# EAGLE design Sonde (EAGLE 8.0.2)
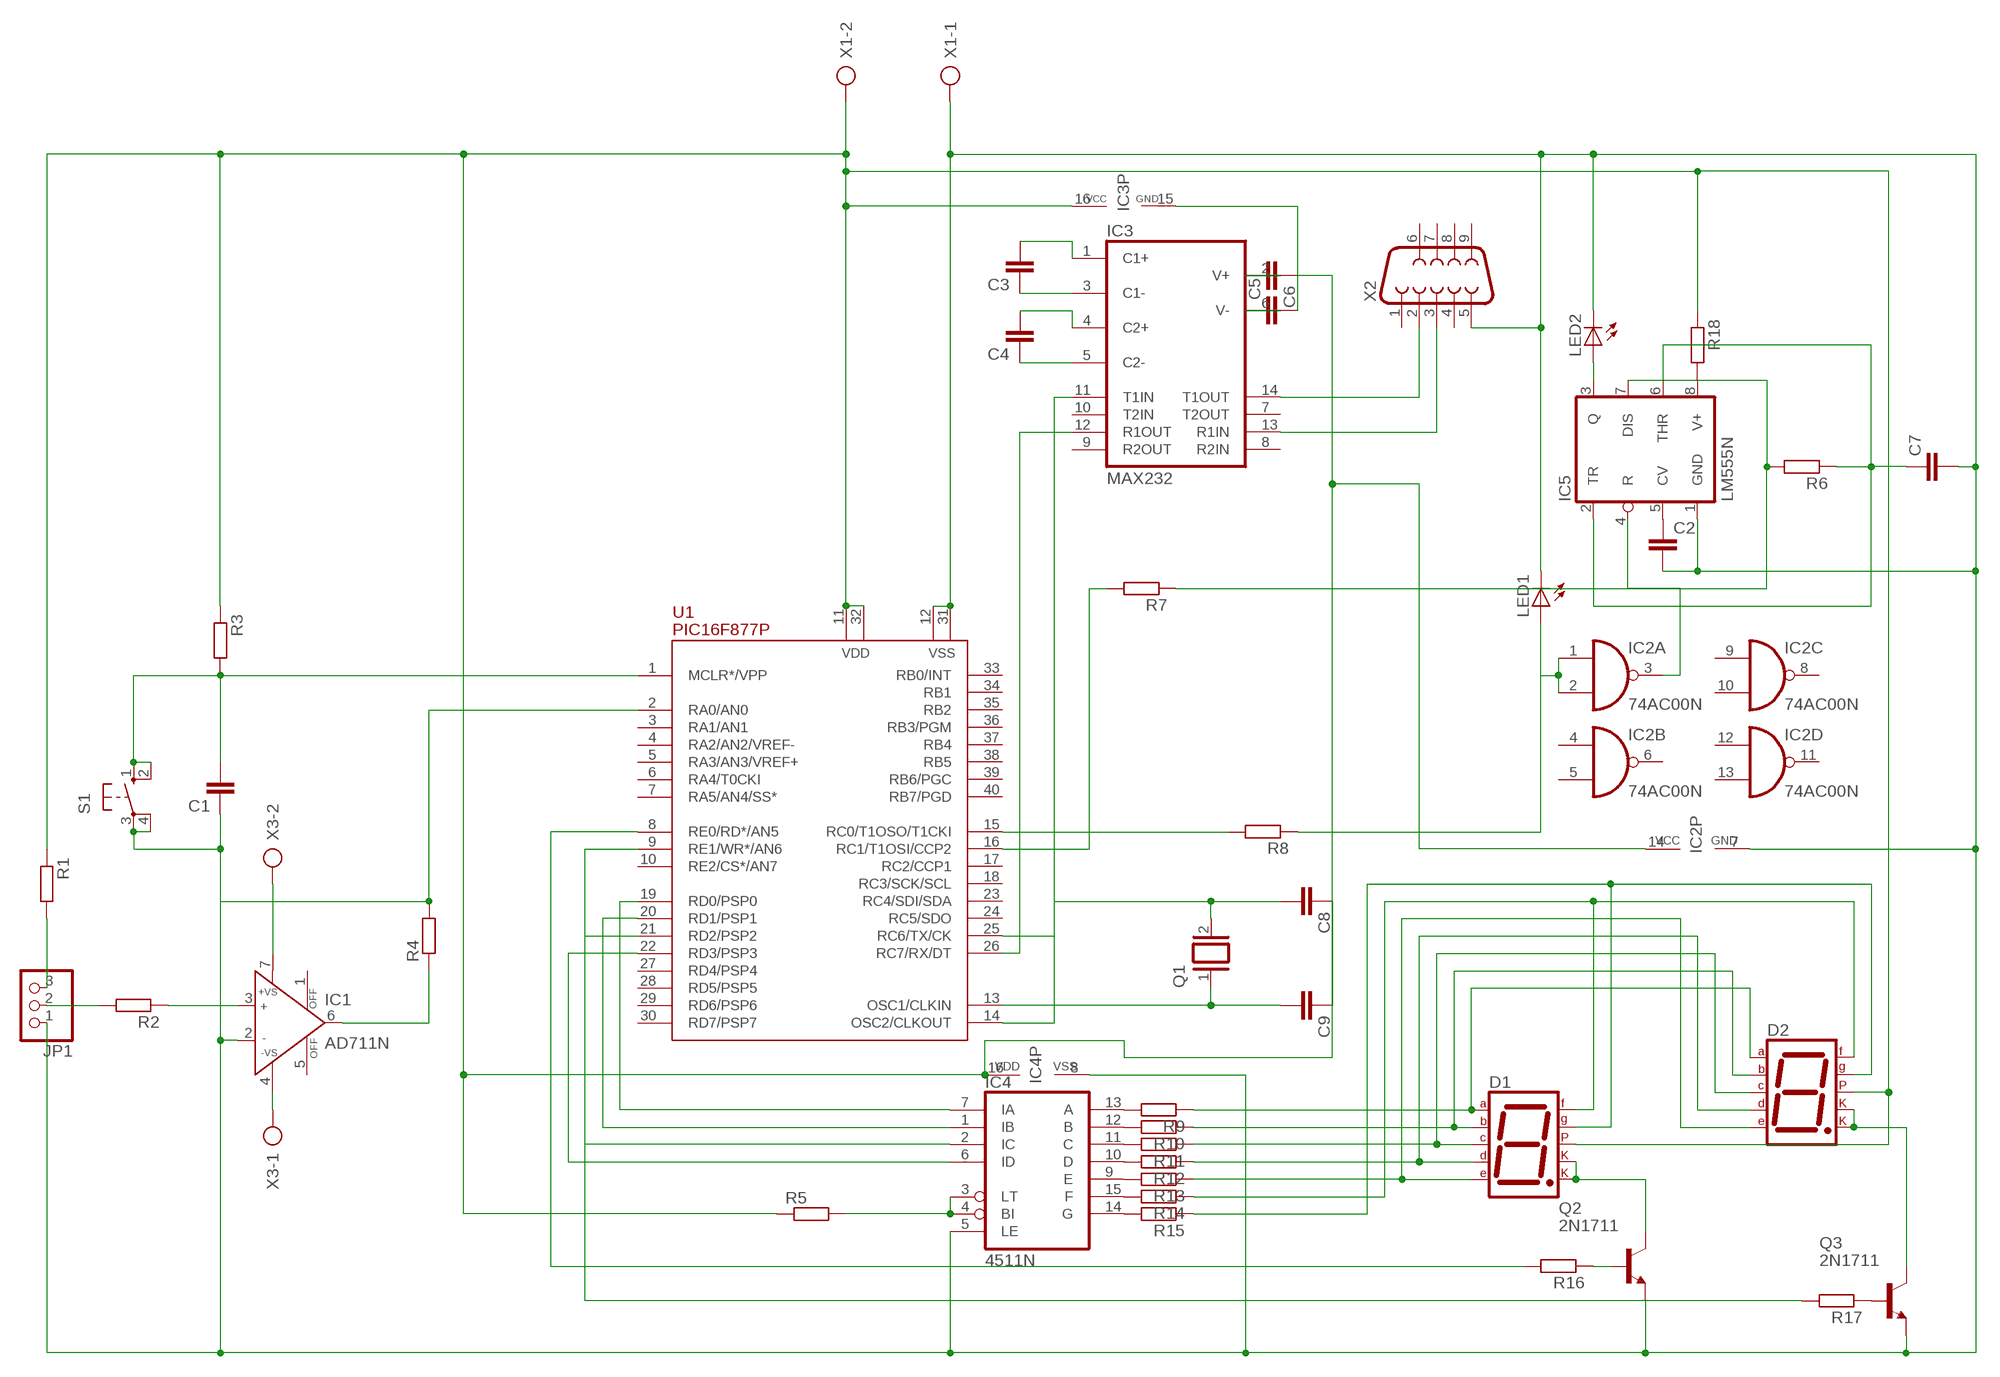
[diagram p0: schematic, sheet 1]

## Parts
C1  C-EU025-024X044  [C025-024X044]
C2  C-EU025-024X044  [C025-024X044]
C3  C-EU025-024X044  [C025-024X044]
C4  C-EU025-024X044  [C025-024X044]
C5  C-EU025-024X044  [C025-024X044]
C6  C-EU025-024X044  [C025-024X044]
C7  C-EU025-024X044  [C025-024X044]
C8  C-EU025-024X044  [C025-024X044]
C9  C-EU025-024X044  [C025-024X044]
D1  7SEG-CK  [7SEG-13]
D2  7SEG-CK  [7SEG-13]
IC1  AD711N  [DIL08]
IC2  74AC00N  [DIL14]
IC3  MAX232  [DIL16]
IC4  4511N  [DIL16]
IC5  LM555N  [DIL08]
JP1  PINHD-1X3  [1X03]
LED1  LED_ELD260  [LED_LD260]
LED2  LED_ELD260  [LED_LD260]
Q1  XTAL/S  [QS]
Q2  2N1711  [TO39]
Q3  2N1711  [TO39]
R1  R-EU_0207/10  [0207/10]
R2  R-EU_0207/10  [0207/10]
R3  R-EU_0207/10  [0207/10]
R4  R-EU_0207/10  [0207/10]
R5  R-EU_0207/10  [0207/10]
R6  R-EU_0207/10  [0207/10]
R7  R-EU_0207/10  [0207/10]
R8  R-EU_0207/10  [0207/10]
R9  R-EU_0207/10  [0207/10]
R10  R-EU_0207/10  [0207/10]
R11  R-EU_0207/10  [0207/10]
R12  R-EU_0207/10  [0207/10]
R13  R-EU_0207/10  [0207/10]
R14  R-EU_0207/10  [0207/10]
R15  R-EU_0207/10  [0207/10]
R16  R-EU_0207/10  [0207/10]
R17  R-EU_0207/10  [0207/10]
R18  R-EU_0207/10  [0207/10]
S1  10-XX  [B3F-10XX]
U1  PIC16F877P  [DIL40]
X1  AK300/2  [AK300/2]
X2  F09V  [F09V]
X3  AK300/2  [AK300/2]

## Nets
N$1: C1.1 C2.2 C7.2 IC1.2(IN-) IC2.7(P:GND) IC4.5(LE) IC4.8(VSS) IC5.1(GND) JP1.1 LED1.K(C) LED2.K(C) Q2.1(E) Q3.1(E) R4.2 S1.3(P) S1.4(P1) U1.2(RA0/AN0) U1.12(VSS) U1.31(VSS) X1.1 X2.5
N$2: IC1.4(-VS) X3.1
N$3: D2.3(CK1) D2.8(CK2) Q3.3(C)
N$4: JP1.3 R1.2
N$5: C9.2 Q1.1 U1.13(OSC1/CLKIN)
N$6: C8.2 Q1.2 U1.14(OSC2/CLKOUT)
N$7: D1.3(CK1) D1.8(CK2) Q2.3(C)
N$8: C1.2 R3.2 S1.1(S) S1.2(S1) U1.1(MCLR*/VPP)
N$9: Q2.2(B) R16.1
N$10: Q3.2(B) R17.1
N$11: C8.1 C9.1
N$12: C5.2 IC3.15(GND)
N$13: D1.7(A) D2.7(A) R9.1
N$14: C6.2 IC3.2(V+)
N$15: D1.6(B) D2.6(B) R10.1
N$16: D1.4(C) D2.4(C) R11.1
N$17: D1.2(D) D2.2(D) R12.1
N$18: D1.1(E) D2.1(E) R13.1
N$19: C5.1 IC3.6(V-)
N$20: D1.9(F) D2.9(F) R14.1
N$21: IC3.11(T1IN) U1.25(RC6/TX/CK)
N$22: D1.10(G) D2.10(G) R15.1
N$23: IC3.12(R1OUT) U1.26(RC7/RX/DT)
N$24: IC3.14(T1OUT) X2.2
N$25: IC1.6(OUT) R4.1
N$26: C3.1 IC3.3(C1-)
N$27: IC2.1(A:I0) IC2.2(A:I1) LED1.A R8.1
N$28: IC5.3(Q) LED2.A
N$29: C2.1 IC5.5(CV)
N$30: IC4.7(IA) U1.19(RD0/PSP0)
N$31: IC4.1(IB) U1.20(RD1/PSP1)
N$32: IC4.2(IC) U1.21(RD2/PSP2)
N$33: IC4.6(ID) U1.22(RD3/PSP3)
N$34: JP1.2 R2.2
N$35: IC1.3(IN+) R2.1
N$36: C7.1 IC5.2(TR) IC5.6(THR) R6.1
N$37: IC4.3(LT) IC4.4(BI) R5.2
N$38: IC5.7(DIS) R6.2 R7.1
N$39: IC5.8(V+) R18.2
N$40: R16.2 U1.8(RE0/RD*/AN5)
N$41: R7.2 U1.16(RC1/T1OSI/CCP2)
N$42: R8.2 U1.15(RC0/T1OSO/T1CKI)
N$43: R17.2 U1.9(RE1/WR*/AN6)
N$44: IC3.13(R1IN) X2.3
N$45: C3.2 IC3.1(C1+)
N$46: IC2.3(A:O) IC5.4(R)
N$47: C4.2 IC3.4(C2+)
N$48: IC4.13(A) R9.2
N$49: IC4.12(B) R10.2
N$50: IC4.11(C) R11.2
N$51: IC4.10(D) R12.2
N$52: IC4.9(E) R13.2
N$53: IC4.15(F) R14.2
N$54: IC4.14(G) R15.2
N$55: C6.1 D1.5(DP) D2.5(DP) IC2.14(P:VCC) IC3.16(VCC) IC4.16(VDD) R1.1 R3.1 R5.1 R18.1 U1.11(VDD) U1.32(VDD) X1.2
N$56: IC1.7(+VS) X3.2
N$58: C4.1 IC3.5(C2-)
Unconnected: IC1.1(OFF) IC1.5(OFF) IC2.4(B:I0) IC2.5(B:I1) IC2.6(B:O) IC2.8(C:O) IC2.9(C:I0) IC2.10(C:I1) IC2.11(D:O) IC2.12(D:I0) IC2.13(D:I1) IC3.7(T2OUT) IC3.8(R2IN) IC3.9(R2OUT) IC3.10(T2IN) U1.3(RA1/AN1) U1.4(RA2/AN2/VREF-) U1.5(RA3/AN3/VREF+) U1.6(RA4/T0CKI) U1.7(RA5/AN4/SS*) U1.10(RE2/CS*/AN7) U1.17(RC2/CCP1) U1.18(RC3/SCK/SCL) U1.23(RC4/SDI/SDA) U1.24(RC5/SDO) U1.27(RD4/PSP4) U1.28(RD5/PSP5) U1.29(RD6/PSP6) U1.30(RD7/PSP7) U1.33(RB0/INT) U1.34(RB1) U1.35(RB2) U1.36(RB3/PGM) U1.37(RB4) U1.38(RB5) U1.39(RB6/PGC) U1.40(RB7/PGD) X2.1 X2.4 X2.6 X2.7 X2.8 X2.9

## Library data of the parts
C1-C9 = rcl:C-EU: CAPACITOR, European symbol
D1 D2 = special:7SEG-CK: 7-segment DISPLAY single cathode, 13 mm
IC1 = analog-devices:AD711: Precision, Low Cost, High Speed, BiFET Op Amp Source: http://www.analog.com/static/imported-files/data_sheets/AD711.pdf; MPN: AD711BQ; OC_FARNELL: 9604839; OC_NEWARK: 66F5826
IC2 = 74xx-eu:74*00: Quad 2-input NAND gate
IC3 = maxim:MAX232: RS232 TRANSCEIVER; MF: MAXIM; MPN: MAX232ACPE+; OC_FARNELL: 9723773; OC_NEWARK: 68K4544
IC4 = 45xx:4511: BCD to 7-segment LATCH/DECODER/DRIVER
IC5 = linear:*555: TIMER
JP1 = pinhead:PINHD-1X3: PIN HEADER
LED1 LED2 = eagle-ltspice:LED_E: LED Source: http://www.osram.convergy.de Source: www.luxeon.com Source: www.kingbright.com; SPICEMODEL: NONE; SPICEPREFIX: D; SPICETYPE: diode
Q1 = special:XTAL/S: CRYSTAL
Q2 Q3 = transistor-npn:2N1711: NPN Transistor
R1-R18 = rcl:R-EU_: RESISTOR, European symbol
S1 = switch-omron:10-XX: OMRON SWITCH; MPN: B3F-1000; OC_FARNELL: 176432; OC_NEWARK: 36M3542
U1 = pic16f87x:PIC16F877: FLASH MICROCONTROLLER
X1 X3 = con-ptr500:AK300/2: CONNECTOR; OC_FARNELL: unknown; OC_NEWARK: unknown
X2 = con-subd:F09: SUB-D; OC_FARNELL: unknown; OC_NEWARK: unknown

## Board
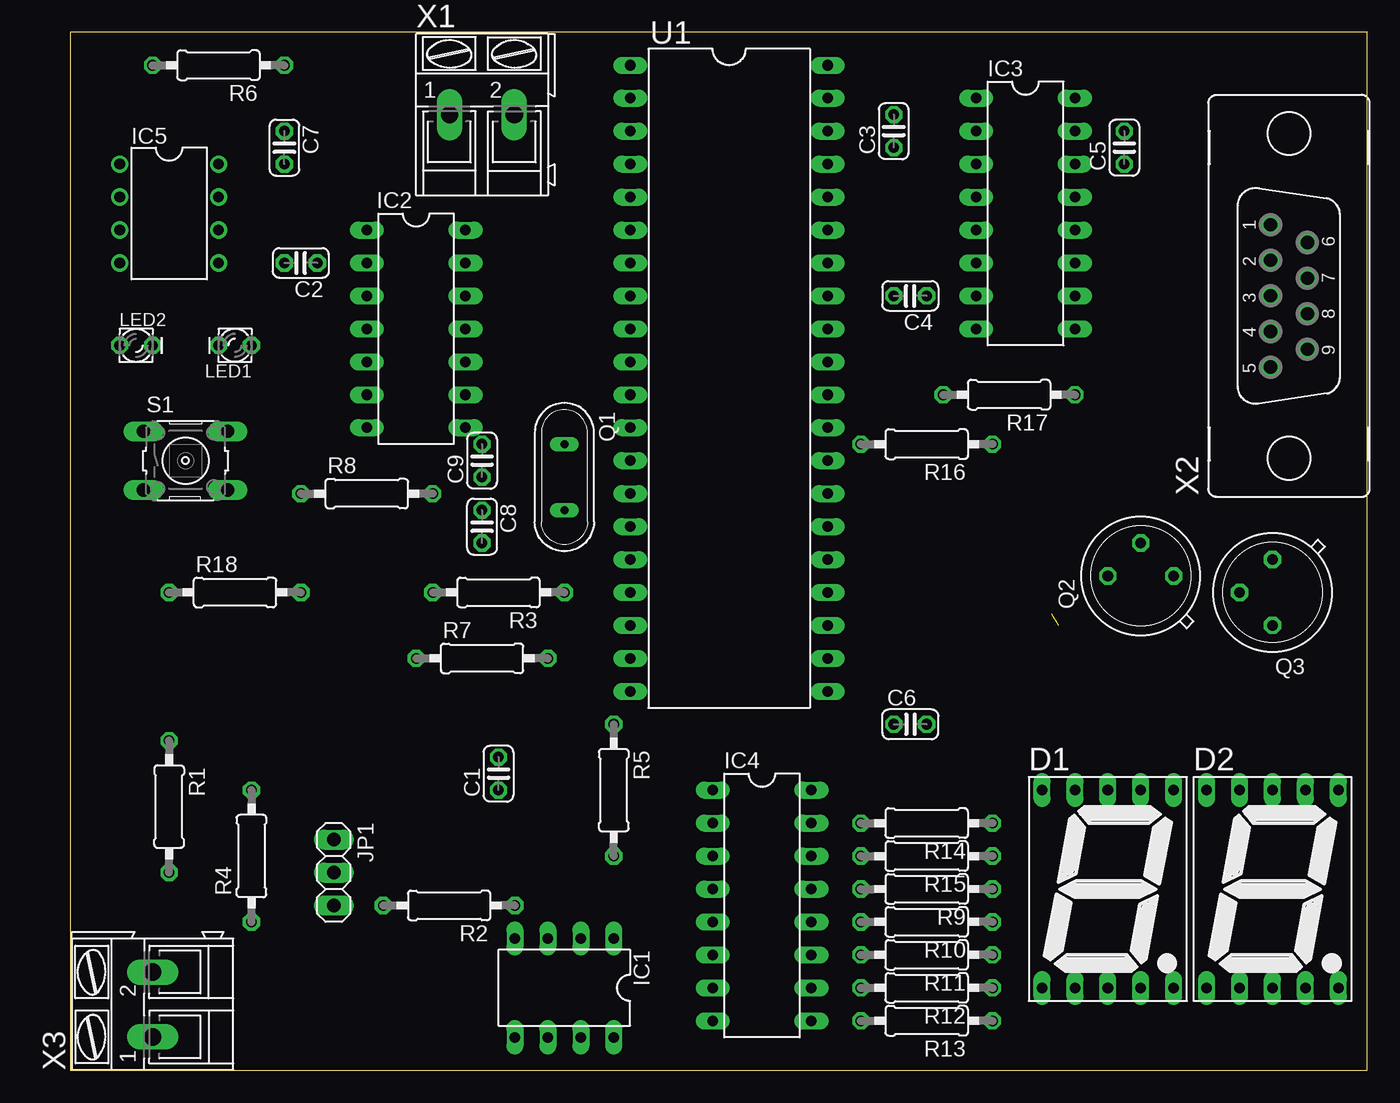
[diagram p1: board, top side]
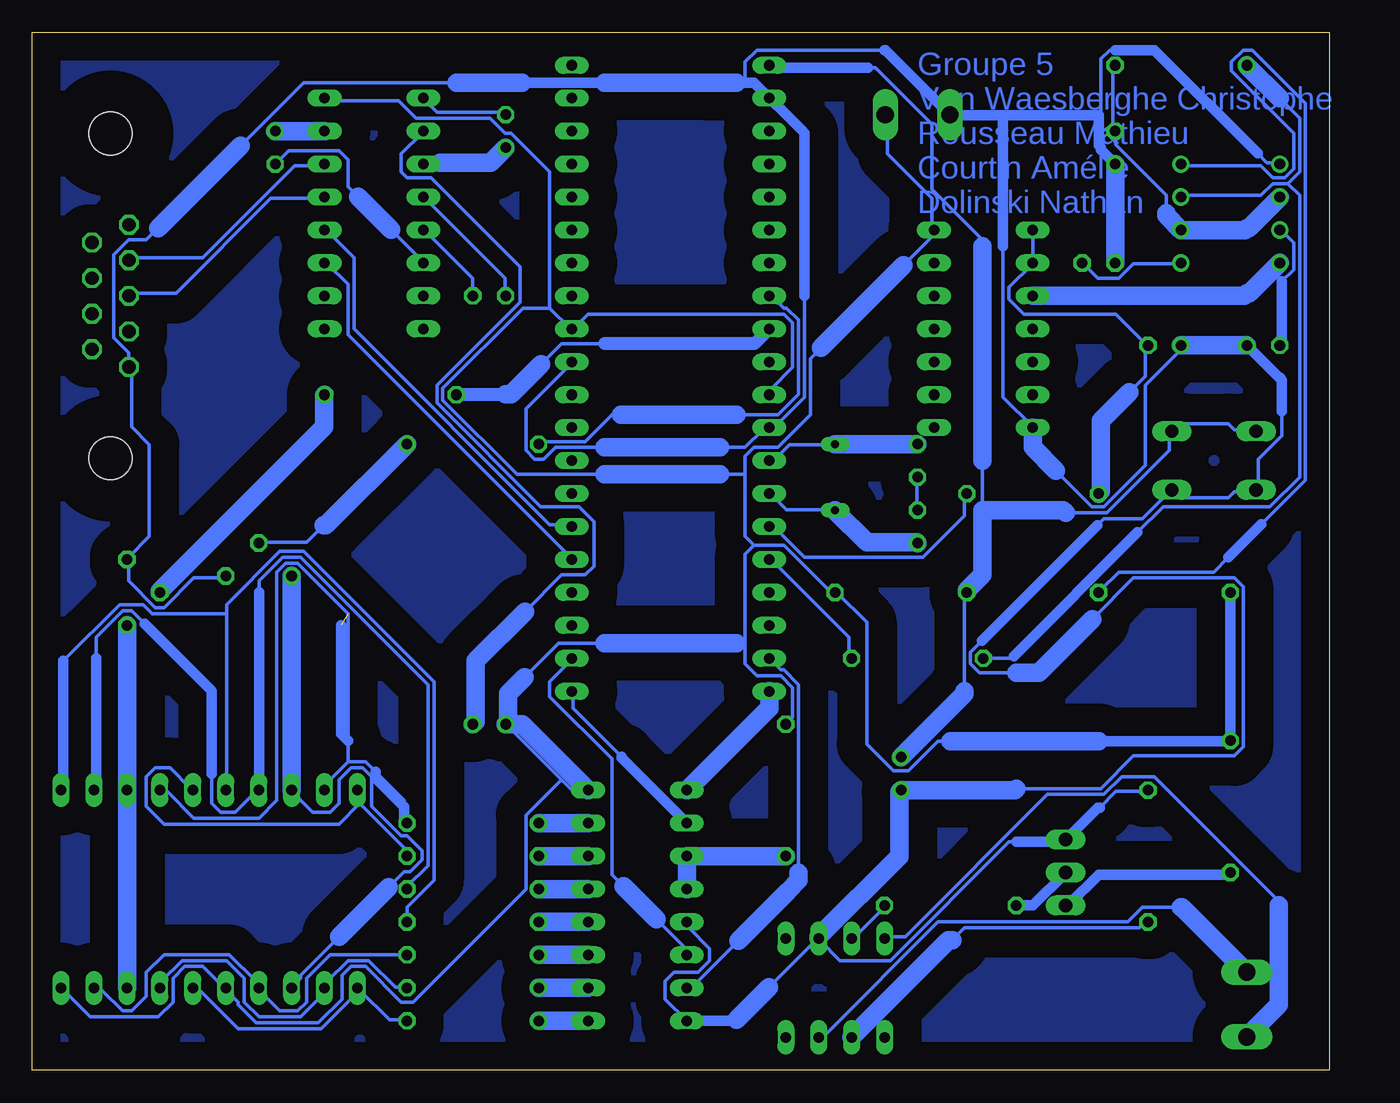
[diagram p2: board, bottom side, seen from below]

Size 100 x 80 mm. Coordinates in mm from the lower left corner, seen from the top.
Outline: 0,0 100,0 100,80 0,80 0,0
Copper layers (1*16): Top 0.035mm / dielectric 1.5mm / Bottom 0.035mm
Design rules "default": minimum track width 10mil, minimum drill 24mil, track to track 8mil, track to pad 8mil, pad to pad 8mil, via to via 8mil, smd to smd 8mil, copper to edge 40mil, drill to drill 8mil, minimum pad ring 10mil, minimum via ring 8mil, stop-mask expansion 4mil, vias tented up to drill 0mil, thermal gap 10mil

### Footprints (pad centres in the part's own frame; a part is rotated, then mirrored left to right if it is on the bottom)
C025-024X044 = drill 0.813 octagon: 1 -1.27,0; 2 1.27,0
7SEG-13 = drill 0.813 long: 1 -5.08,-7.62; 2 -2.54,-7.62; 3 0,-7.62; 4 2.54,-7.62; 5 5.08,-7.62; 6 5.08,7.62; 7 2.54,7.62; 8 0,7.62; 9 -2.54,7.62; 10 -5.08,7.62
DIL08 = drill 0.813 long: 1 -3.81,-3.81; 2 -1.27,-3.81; 3 1.27,-3.81; 4 3.81,-3.81; 5 3.81,3.81; 6 1.27,3.81; 7 -1.27,3.81; 8 -3.81,3.81
DIL14 = drill 0.813 long: 1 -7.62,-3.81; 2 -5.08,-3.81; 3 -2.54,-3.81; 4 0,-3.81; 5 2.54,-3.81; 6 5.08,-3.81; 7 7.62,-3.81; 8 7.62,3.81; 9 5.08,3.81; 10 2.54,3.81; 11 0,3.81; 12 -2.54,3.81; 13 -5.08,3.81; 14 -7.62,3.81
DIL16 = drill 0.813 long: 1 -8.89,-3.81; 2 -6.35,-3.81; 3 -3.81,-3.81; 4 -1.27,-3.81; 5 1.27,-3.81; 6 3.81,-3.81; 7 6.35,-3.81; 8 8.89,-3.81; 9 8.89,3.81; 10 6.35,3.81; 11 3.81,3.81; 12 1.27,3.81; 13 -1.27,3.81; 14 -3.81,3.81; 15 -6.35,3.81; 16 -8.89,3.81
DIL08' = drill 0.813 pad 1.27: 1 -3.81,-3.81; 2 -1.27,-3.81; 3 1.27,-3.81; 4 3.81,-3.81; 5 3.81,3.81; 6 1.27,3.81; 7 -1.27,3.81; 8 -3.81,3.81
1X03 = drill 1.016 long: 1 -2.54,0; 2 0,0; 3 2.54,0
LED_LD260 = drill 0.813 octagon: A -1.27,0; K 1.27,0
QS = drill 0.61 long: 1 -2.54,0; 2 2.54,0
TO39 = drill 0.813 octagon: 1 0,-2.54; 2 2.54,0; 3 0,2.54
0207/10 = drill 0.813 octagon: 1 -5.08,0; 2 5.08,0
B3F-10XX = drill 1.016 long: 1 -3.251,2.261; 2 3.251,2.261; 3 -3.251,-2.261; 4 3.251,-2.261
DIL40 = drill 0.813 long: 1 -24.13,-7.62; 2 -21.59,-7.62; 3 -19.05,-7.62; 4 -16.51,-7.62; 5 -13.97,-7.62; 6 -11.43,-7.62; 7 -8.89,-7.62; 8 -6.35,-7.62; 9 -3.81,-7.62; 10 -1.27,-7.62; 11 1.27,-7.62; 12 3.81,-7.62; 13 6.35,-7.62; 14 8.89,-7.62; 15 11.43,-7.62; 16 13.97,-7.62; 17 16.51,-7.62; 18 19.05,-7.62; 19 21.59,-7.62; 20 24.13,-7.62; 21 24.13,7.62; 22 21.59,7.62; 23 19.05,7.62; 24 16.51,7.62; 25 13.97,7.62; 26 11.43,7.62; 27 8.89,7.62; 28 6.35,7.62; 29 3.81,7.62; 30 1.27,7.62; 31 -1.27,7.62; 32 -3.81,7.62; 33 -6.35,7.62; 34 -8.89,7.62; 35 -11.43,7.62; 36 -13.97,7.62; 37 -16.51,7.62; 38 -19.05,7.62; 39 -21.59,7.62; 40 -24.13,7.62
AK300/2 = drill 1.321 long: 1 -2.515,0; 2 2.489,0
F09V = drill 1.016 octagon: 1 5.486,1.422; 2 2.743,1.422; 3 0,1.422; 4 -2.743,1.422; 5 -5.486,1.422; 6 4.115,-1.422; 7 1.372,-1.422; 8 -1.372,-1.422; 9 -4.115,-1.422 | hole 3.302: -12.522,0; 12.522,0

### Placement (x,y rotation side)
C1  33.02,22.86 90 top
C2  17.78,62.23 180 top
C3  63.5,72.39 90 top
C4  64.77,59.69 180 top
C5  81.28,71.12 90 top
C6  64.77,26.67 0 top
C7  16.51,71.12 270 top
C8  31.75,41.91 270 top
C9  31.75,46.99 90 top
D1  80.01,13.97 0 top
D2  92.71,13.97 0 top
IC1  38.1,6.35 180 top
IC2  26.67,57.15 270 top
IC3  73.66,66.04 270 top
IC4  53.34,12.7 270 top
IC5  LM555N  [DIL08']  7.62,66.04 270 top
JP1  20.32,15.24 270 top
LED1  12.7,55.88 180 top
LED2  5.08,55.88 0 top
Q1  38.1,45.72 270 top
Q2  82.55,38.1 90 top
Q3  92.71,36.83 180 top
R1  7.62,20.32 270 top
R2  29.21,12.7 180 top
R3  33.02,36.83 180 top
R4  13.97,16.51 90 top
R5  41.91,21.59 270 top
R6  11.43,77.47 180 top
R7  31.75,31.75 0 top
R8  22.86,44.45 0 top
R9  66.04,13.97 180 top
R10  66.04,11.43 180 top
R11  66.04,8.89 180 top
R12  66.04,6.35 180 top
R13  66.04,3.81 180 top
R14  66.04,19.05 180 top
R15  66.04,16.51 180 top
R16  66.04,48.26 180 top
R17  72.39,52.07 180 top
R18  12.7,36.83 0 top
S1  8.89,46.99 0 top
U1  50.8,53.34 270 top
X1  31.75,73.66 0 top
X2  93.98,59.69 90 top
X3  6.35,5.08 90 top

### Tracks (layer width: path | path; a pad name or v marks a point on that pad's centre or on a via)
N$1
  Bottom 0.254: Q2.1 85.27,37.95 87.55,37.95 89.84,35.66 90.53,35.66 92.58,37.72 92.58,39.32 Q3.1 92.58,39.55 90.98,41.15 90.98,48.23 92.35,49.61 92.35,54.18 X2.5 92.58,54.41 92.58,55.32 93.73,56.46 93.73,62.87 92.58,64.01 91.21,64.01 90.31,64.91 83.96,71.26 79.1,76.12 67.31,76.12 62.23,76.12 55.88,76.12 48.26,76.12 46.99,76.12 45.72,76.12 45.03,76.12 | U1.31 58.52,54.41 61.95,50.98 61.95,47.78 61.27,47.09 60.58,47.09 59.66,48.01 55.88,48.01 46.99,48.01 45.03,48.01 43.66,49.38 43.2,49.38 U1.12 42.98,49.61 42.52,50.06 42.29,50.06 40.46,51.89 40.46,59.69 40.46,72.24 40.63,72.4 42.98,74.75 U1.2 43.2,74.98 44.35,76.12 45.03,76.12 | R4.2 14.17,21.49 16.46,21.49 17.7,20.24 20.12,17.83 JP1.1 20.34,17.6 24.13,17.6 24.69,17.6 33.83,8.46 37.72,8.46 39.32,10.06 IC1.2 | IC1.2 39.55,10.06 43.22,6.39 45.72,3.89 49.38,3.89 IC4.8 51.21,5.49 51.21,6.86 50.52,7.54 48.69,7.54 47.78,8.46 47.78,9.37 49.38,10.97 49.38,11.43 IC4.5 | IC1.2 39.32,10.29 33.15,16.46 33.15,16.51 33.15,21.49 C1.1 32.92,21.72 24.13,21.72 17.6,21.72 15.09,24.23 7.32,24.23 6.63,24.92 6.63,37.26 7.32,37.95 15.09,37.95 18.26,34.77 22.4,30.63 24.13,30.63 26.98,30.63 27.66,31.32 27.66,32.23 26.77,33.12 17.88,42.01 17.37,42.52 14.4,42.52 12.34,44.58 S1.4 12.12,44.58 11.66,44.12 7.77,44.12 7.32,44.58 5.71,44.58 S1.3 5.49,44.81 5.49,47.09 3.66,48.92 3.66,50.8 3.66,53.26 3.77,53.38 6.17,55.78 LED2.K 6.4,56.01 11.43,56.01 LED1.K 11.43,55.55 14.17,52.81 14.17,46.63 17.37,43.43 18.29,43.43 21.08,46.23 22.86,48.01 IC2.7 22.86,49.61 25.15,51.89 25.15,63.5 25.15,73.61
  Bottom 0.254: 17.6,73.61 17.6,71.12 17.6,70.87 16.69,69.95 C7.2 16.69,69.72 16.69,62.41 C2.2 | 17.6,73.61 17.6,77.95 16.92,78.64 16.51,78.64 13.97,78.64 13.49,78.64 5.52,70.67 4.8,69.95 3.89,69.95 IC5.1 | 17.6,73.61 17.78,73.61 24.13,73.61 25.15,73.61 | 25.15,73.61 25.4,73.61 29.03,73.61 X1.1 29.26,73.84 34.06,78.64 34.29,78.64 44.12,78.64 45.03,77.72 45.03,76.12
  Bottom 0.813: 62.23,76.12 55.88,76.12 48.26,76.12 46.99,76.12 45.72,76.12 44.35,76.12 40.63,72.4 | 40.46,72.24 40.46,59.69 | 34.29,78.64 34.21,78.64 X1.1 29.18,73.61 25.4,73.61 | 25.4,73.61 24.13,73.61 | 25.4,73.61 17.78,73.61 17.78,71.3 17.6,71.12 17.6,70.94 C7.2 | 25.15,73.61 25.15,63.5 | 5.52,70.67 13.49,78.64 13.97,78.64 16.51,78.64 | LED2.K 3.85,53.38 | 3.85,53.38 3.77,53.38 | 3.85,53.38 3.66,53.19 3.66,50.8 | 17.88,42.01 26.77,33.12 | 17.7,20.24 17.86,20.24 JP1.1 20.5,17.6 24.13,17.6 | 45.72,3.89 45.8,3.81 IC4.8
  Bottom 1.422: 18.26,34.77 22.4,30.63 24.13,30.63 | 43.22,6.39 45.72,3.89 | C7.2 C2.2 | LED2.K LED1.K | 33.15,16.51 33.15,21.46 C1.1 24.26,21.59 24.13,21.72 | 33.15,16.51 33.15,16.46 | 33.15,16.51 39.37,10.29 IC1.2 | 83.96,71.26 90.31,64.91 | 62.23,76.12 67.31,76.12 | 46.99,48.01 55.88,48.01 | 46.99,76.12 48.26,76.12 | 48.26,76.12 55.88,76.12 | 48.26,76.12 45.72,76.12 | 21.08,46.23 22.86,48.01 IC2.7
N$2
  Bottom 0.254: X3.1 3.89,5.03 3.89,12.7 3.89,13.03 13.49,22.63 16,22.63 17.37,21.26 21.72,21.26 32.69,10.29 34.29,10.29 IC1.4
  Bottom 1.422: X3.1 3.89,5.03 3.89,12.7
N$3
  Bottom 0.254: D2.3 92.81,6.4 92.81,21.49 D2.8 92.81,21.72 92.81,34.29 Q3.3
  Bottom 1.422: Q3.3 D2.8 D2.3
N$4
  Bottom 0.254: R1.2 7.77,15.09 17.78,15.09 17.83,15.09 20.12,12.8 JP1.3
  Bottom 0.813: R1.2 7.77,15.09 17.78,15.09 20.17,12.7 JP1.3
N$5
  Bottom 0.254: U1.13 42.98,46.86 41.6,48.23 38.18,48.23 Q1.1 37.95,48.46 31.77,48.46 C9.2
  Bottom 1.422: C9.2 Q1.1
N$6
  Bottom 0.254: U1.14 42.98,44.35 41.83,43.2 38.18,43.2 Q1.2 37.95,42.98 35.66,40.69 31.77,40.69 C8.2
  Bottom 1.422: C8.2 31.8,40.69 35.66,40.69 38.1,43.13 Q1.2
N$7
  Bottom 0.254: D1.3 80.01,6.4 79.32,7.09 79.32,7.32 76.34,10.3 72.53,14.11 71.32,15.32 70.87,15.32 69.95,16.23 69.95,16.92 71.09,18.06 71.55,18.06 73.84,20.34 73.84,22.63 74.52,23.32 75.44,23.32 76.35,22.4 76.35,20.57 77.04,19.89 78.41,19.89 80.01,21.49 D1.8 Q2.3
  Bottom 1.422: Q2.3 D1.8 | 72.53,14.11 76.34,10.3
N$8
  Bottom 0.254: S1.1 5.71,49.38 7.32,49.38 7.77,49.84 11.66,49.84 12.12,49.38 S1.2 12.34,49.15 12.34,47.78 17.14,42.98 20.32,42.98 26.67,42.98 26.75,42.98 | C1.2 28.12,29.03 28.12,29.21 28.12,36.8 R3.2 27.89,37.03 26.75,38.18 26.75,42.98 | 26.75,42.98 26.75,43.18 26.75,46.99 26.75,49.53 26.75,63.5 26.75,64.01 30.63,67.89 30.63,72.92 34.98,77.27 35.56,77.27 42.98,77.27 U1.1
  Bottom 0.813: U1.1 42.98,77.27 35.56,77.27
  Bottom 1.422: 20.32,42.98 20.52,43.18 26.75,43.18 | 26.67,42.98 26.75,42.9 26.75,38.18 27.94,36.98 R3.2 | C1.2 28.12,29.03 28.12,29.21 | 26.75,63.5 26.75,49.53 26.75,46.99
N$9
  Bottom 0.254: Q2.2 82.53,40.69 78.87,40.69 77.56,42 71.32,48.23 R16.1
  Bottom 1.422: R16.1 77.38,42 77.56,42
N$10
  Bottom 0.254: R17.1 77.5,51.89 77.5,49.61 90.07,37.03 Q3.2
  Bottom 1.422: R17.1 77.5,52.05 77.5,49.61 90.17,36.93 Q3.2
N$11
  Bottom 0.254: C8.1 31.77,43.2 31.77,45.72 C9.1
N$12
  Bottom 0.254: IC3.15 77.5,72.47 81.15,72.47 C5.2
  Bottom 1.422: IC3.15 C5.2
N$13
  Bottom 0.254: R9.1 71.09,14.17 69.49,15.77 69.49,29.72 79.32,39.55 80.7,39.55 82.53,37.72 82.53,36.83 82.53,21.72 D1.7 82.75,21.49 84.35,19.89 85.5,19.89 86.18,20.57 86.18,22.86 86.18,29.21 86.18,29.26 86.25,29.32 91.33,34.4 92.35,35.43 93.04,35.43 95.1,33.38 95.1,31.75 95.1,21.72 D2.7
  Bottom 0.813: D2.7 95.1,21.74 95.1,31.75 | 86.25,29.32 91.33,34.4 | 86.18,29.21 86.18,22.86 | D1.7 82.53,21.61 82.53,36.83
N$14
  Bottom 0.254: C6.2 65.84,26.75 65.84,31.55 62.03,35.36 59.21,38.18 57.38,38.18 56.69,38.86 56.69,42.29 57.84,43.43 60.81,43.43 68.81,51.44 68.81,52.81 62.41,59.21 62.41,61.95 69.27,68.81 71.09,68.81 71.55,69.27 71.55,70.64 69.95,72.24 IC3.2
  Bottom 1.422: C6.2 65.84,26.87 65.84,31.55 62.03,35.36
N$15
  Bottom 0.254: 85.04,35.2 85.04,21.72 D1.6 | 85.04,35.2 85.04,35.89 80.92,40.01 79.1,40.01 69.04,29.95 69.04,14.63 71.09,12.57 71.09,11.43 R10.1 | 85.04,35.2 90.75,35.2 91.44,35.89 93.27,35.89 97.61,31.55 97.61,21.72 D2.6
  Bottom 0.813: D2.6 97.61,21.77 97.61,31.55
N$16
  Bottom 0.254: R11.1 71.32,8.91 77.04,8.91 78.87,7.09 78.87,5.26 79.55,4.57 80.92,4.57 82.53,6.17 D1.4 82.75,6.4 82.75,6.86 84.81,8.91 89.84,8.91 91.21,7.54 91.21,5.71 92.35,4.57 93.04,4.57 94.64,6.17 95.1,6.17 D2.4
N$17
  Bottom 0.254: R12.1 71.32,6.4 72.01,6.4 74.07,8.46 75.67,8.46 77.27,6.86 77.27,6.4 D1.2 77.27,6.17 79.32,4.12 82.53,4.12 83.67,5.26 83.67,7.09 85.04,8.46 88.47,8.46 90.07,6.86 90.07,6.4 D2.2
N$18
  Bottom 0.254: 74.75,6.17 72.47,3.89 71.32,3.89 R13.1 | 74.75,6.17 77.72,3.2 84.12,3.2 87.1,6.17 87.55,6.17 D2.1 | 74.75,6.17 D1.1
N$19
  Bottom 0.254: IC3.6 69.95,62.41 72.35,64.81 74.89,67.35 75.67,68.12 75.67,70.18 76.35,70.87 80.24,70.87 81.15,69.95 C5.1
  Bottom 1.422: 72.35,64.81 74.89,67.35
N$20  (1 unrouted)
  Bottom 0.254: 75.67,23.77 74.3,23.77 73.52,23 71.32,20.8 71.32,20.32 71.32,19.2 R14.1 | 75.67,23.77 77.27,22.17 77.27,21.72 D1.9 | 75.67,23.77 75.67,35.2 79.55,39.09 80.47,39.09 81.15,38.41 81.15,20.8 82.53,19.43 87.55,19.43 89.61,21.49 90.07,21.49 D2.9
  Bottom 0.813: R14.1 71.32,19.25 71.32,20.32 73.52,22.52 73.52,23 | 75.67,25.4 76.2,25.93 76.2,34.29
N$21
  Bottom 0.254: U1.25 58.52,39.55 75.67,56.69 75.67,60.58 77.27,62.18 IC3.11
N$22
  Bottom 0.254: 74.75,20.57 71.32,17.14 71.32,16.69 R15.1 | 74.75,20.57 74.75,21.49 D1.10 74.75,20.57 | 74.75,20.57 76.35,18.97 89.84,18.97 91.21,20.34 91.21,22.63 90.53,23.32 89.38,23.32 87.78,21.72 D2.10
N$23
  Bottom 0.254: U1.26 58.52,42.06 60.12,42.06 75.21,57.15 75.21,62.64 77.27,64.69 IC3.12
N$24
  Bottom 0.254: IC3.14 77.5,69.72 79.78,69.72 86.87,62.64 92.35,62.64 X2.2
N$25
  Bottom 0.254: IC1.6 36.8,2.74 36.35,2.74 29.07,10.02 28.12,10.97 14.63,10.97 14.17,11.43 R4.1
  Bottom 1.422: IC1.6 29.35,10.02 29.07,10.02
N$26
  Bottom 0.254: IC3.3 69.72,69.95 68.58,69.95 64.69,69.95 63.55,71.09 C3.1
  Bottom 1.422: C3.1 64.67,69.95 68.58,69.95
N$27
  Bottom 0.254: IC2.1 IC2.2 22.86,62.18 24.69,60.35 24.69,59.44 23.55,58.29 16.46,58.29 14.17,56.01 LED1.A 14.17,55.78 14.17,53.49 15.42,52.25 17.6,50.06 17.6,49.53 17.6,44.58 R8.1
  Bottom 1.422: R8.1 17.6,44.63 17.6,49.53 17.6,50.06 15.42,52.25
N$28
  Bottom 0.254: LED2.A 3.66,56.01 3.66,60.81 2.74,61.72 2.74,63.78 3.66,64.69 IC5.3
  Bottom 0.813: LED2.A 3.66,56.03 3.66,60.81
N$29
  Bottom 0.254: IC5.5 11.43,62.18 15.09,62.18 16.23,61.04 17.83,61.04 18.97,62.18 C2.1
N$30
  Bottom 0.254: U1.19 42.29,30.86 42.06,30.86 40.92,29.72 40.92,15.24 40.92,14.63 41.74,13.8 45.55,9.99 49.38,6.17 IC4.7
  Bottom 1.422: 45.55,9.99 41.74,13.8 40.92,14.63 40.92,15.24
N$31
  Bottom 0.254: U1.20 43.2,29.03 43.2,27.89 49.38,21.72 IC4.1
  Bottom 1.422: IC4.1 49.51,21.59 43.2,27.89 43.18,27.91 U1.20
N$32
  Bottom 0.254: IC4.2 49.61,19.2 54.57,24.17 58.29,27.89 58.29,29.03 U1.21
  Bottom 0.813: IC4.2 54.57,24.09 54.57,24.17
N$33
  Bottom 0.254: IC4.6 49.61,8.91 49.61,9.37 51.87,11.63 54.41,14.17 55.32,15.09 55.32,24 60.12,28.8 60.12,29.95 58.52,31.55 U1.22
  Bottom 1.422: 51.87,11.63 54.41,14.17
N$34
  Bottom 0.254: R2.2 24,12.8 22.63,12.8 20.34,15.09 JP1.2
  Bottom 0.813: JP1.2 22.86,12.7 R2.2
N$35
  Bottom 0.254: R2.1 34.29,12.57 36.8,10.06 IC1.3
N$36
  Bottom 0.254: R6.1 16.69,77.27 16.69,72.47 C7.1 16.46,72.24 16.46,71.32 12.57,67.44 12.57,66.06 11.43,64.92 | 11.43,64.92 6.35,64.92 6.17,64.92 3.89,67.21 IC5.2 | 11.43,64.92 IC5.6
  Bottom 1.422: IC5.2 6.2,64.92 6.35,64.92 6.5,64.77 IC5.6 12.57,65.91 12.57,66.06
N$37
  Bottom 0.254: IC4.4 49.61,14.17 49.61,16.46 IC4.3 49.38,16.69 42.06,16.69 R5.2
  Bottom 1.422: R5.2 IC4.3 IC4.4
N$38
  Bottom 0.254: 3.2,68.35 4.34,68.35 5.26,67.44 11.43,67.44 IC5.7 | 3.2,68.35 2.29,69.27 2.29,73.38 3.82,74.92 6.17,77.27 R6.2 | 3.2,68.35 2.29,67.44 2.29,45.72 4.57,43.43 12.8,43.43 14.78,41.45 24.31,31.93 24.46,31.77 26.52,31.77 R7.1
  Bottom 0.813: 14.78,41.45 24.31,31.93
  Bottom 1.422: 3.82,74.92 6.35,77.44 R6.2
N$39
  Bottom 0.254: IC5.8 11.43,69.72 5.26,69.72 4.34,68.81 3.43,68.81 2.74,69.49 2.74,72.24 7.54,77.04 7.54,77.72 6.63,78.64 5.94,78.64 1.83,74.52 1.83,45.49 5.25,42.08 7.79,39.53 8.91,38.41 16.23,38.41 17.6,37.03 R18.2
  Bottom 0.813: 5.25,42.08 7.79,39.53
N$40
  Bottom 0.254: U1.8 42.98,59.66 42.06,58.75 41.83,58.75 40.92,57.84 40.92,52.12 42.52,50.52 45.72,50.52 54.61,50.52 55.32,50.52 57.38,48.46 60.81,48.46 R16.2
  Bottom 0.813: 54.61,50.52 45.72,50.52
  Bottom 1.422: 45.72,50.52 54.61,50.52
N$41
  Bottom 0.254: R7.2 37.03,31.77 37.03,33.38 42.98,39.32 U1.16
N$42
  Bottom 0.254: R8.2 28.12,44.35 28.12,42.75 31.32,39.55 40.46,39.55 42.98,42.06 U1.15
N$43
  Bottom 0.254: R17.2 67.21,52.12 63.5,52.12 63.09,52.12 60.78,54.43 59.21,56.01 55.88,56.01 44.35,56.01 43.2,57.15 U1.9
  Bottom 1.016: U1.9 44.32,56.01 55.88,56.01 | R17.2 67.26,52.12 63.5,52.12
  Bottom 1.422: 60.78,54.43 63.09,52.12 63.5,52.12
N$44
  Bottom 0.254: IC3.13 77.5,67.21 81.61,67.21 88.92,59.89 92.35,59.89 X2.3
N$45
  Bottom 0.254: C3.2 63.55,73.84 68.81,73.84 69.72,74.75 IC3.1
N$46
  Bottom 0.254: IC2.3 22.86,59.89 6.35,59.89 6.17,59.89 3.89,62.18 IC5.4
  Bottom 1.422: IC5.4 6.15,59.89 6.35,59.89 6.55,59.69 IC2.3
N$47
  Bottom 0.254: C4.2 63.55,59.89 63.55,61.04 69.72,67.21 IC3.4
N$48
  Bottom 0.254: IC4.13 57.15,14.17 60.81,14.17 R9.2
  Bottom 1.422: IC4.13 R9.2
N$49
  Bottom 0.254: R10.2 IC4.12
  Bottom 1.422: IC4.12 R10.2
N$50
  Bottom 0.254: IC4.11 57.15,8.91 60.81,8.91 R11.2
  Bottom 1.422: IC4.11 R11.2
N$51
  Bottom 0.254: IC4.10 57.15,6.4 60.81,6.4 R12.2
  Bottom 1.422: IC4.10 R12.2
N$52
  Bottom 0.254: IC4.9 57.15,3.89 60.81,3.89 R13.2
  Bottom 1.422: IC4.9 R13.2
N$53
  Bottom 0.254: IC4.15 57.15,19.2 60.81,19.2 R14.2
  Bottom 1.422: IC4.15 R14.2
N$54
  Bottom 0.254: IC4.14 57.15,16.69 60.81,16.69 R15.2
  Bottom 1.422: IC4.14 R15.2
N$55
  Bottom 0.254: U1.11 42.98,52.12 42.98,52.58 41.38,54.18 41.38,57.61 42.06,58.29 57.15,58.29 58.29,57.15 U1.32 58.52,57.15 60.12,58.75 | 60.12,58.75 60.12,69.27 63.09,72.24 63.55,72.24 64.69,73.38 70.41,73.38 71.78,74.75 77.27,74.75 IC3.16 | X1.2 34.06,73.61 34.06,70.64 30.63,67.21 30.63,64.92 IC2.14 30.63,64.69 30.63,64.24 32.83,62.04 39.18,55.69 40.01,54.86 40.01,50.52 42.52,48.01 44.35,48.01 45.03,47.32 45.03,45.95 | D2.5 95.56,4.12 90.3,4.12 89.15,5.26 89.15,7.09 88.24,8 86.87,8 85.27,6.4 D1.5 85.04,6.17 84.12,5.26 84.12,5.03 82.75,3.66 77.95,3.66 76.12,5.49 76.12,7.32 75.44,8 74.3,8 71.55,5.26 70.64,5.26 61.95,13.95 61.95,19.66 59.21,22.4 | R18.1 7.77,36.8 7.77,25.6 R1.1 7.77,25.38 17.78,25.38 29.21,25.38 30.18,25.38 32.46,23.09 33.6,23.09 35.66,25.15 35.66,34.52 37.95,36.8 R3.1 38.18,37.03 38.63,37.03 42.06,40.46 44.35,40.46 | 59.21,22.4 63.32,26.52 C6.1 63.32,26.75 63.32,29.03 62.05,30.3 59.44,32.92 55.88,32.92 45.72,32.92 45.03,32.92 | 59.21,22.4 58.52,21.72 57.15,21.72 IC4.16 | 44.35,40.46 45.03,39.78 45.03,32.92 | 45.03,32.92 45.03,31.32 44.12,30.4 42.29,30.4 41.38,29.49 41.38,27.2 R5.1 | 45.03,45.95 45.03,41.15 44.35,40.46 | 60.12,58.75 62.18,58.75 68.35,52.58 68.35,51.66 62.64,45.95 55.88,45.95 46.99,45.95 45.03,45.95
  Bottom 0.813: 17.78,25.38 7.64,25.38 R1.1 R18.1
  Bottom 1.422: 17.78,25.38 29.21,25.38 | IC4.16 62.23,26.67 C6.1 63.32,26.85 63.32,29.03 62.05,30.3 | 46.99,45.95 55.88,45.95 | 45.72,32.92 55.88,32.92 | 32.83,62.04 39.18,55.69
N$56
  Bottom 0.254: IC1.7 39.32,2.74 38.86,2.74 30.18,11.43 15.54,11.43 14.4,12.57 11.43,12.57 11.2,12.57 6.4,7.77 X3.2
  Bottom 1.422: X3.2 11.35,12.57 11.43,12.57
N$57
  pour Bottom (isolate 2.184): 0,0 100.33,0 100.33,80.01 0,80.01
N$58
  Bottom 0.254: C4.1 66.06,59.89 66.06,61.04 69.72,64.69 IC3.5
N$59
  pour Bottom (isolate 2.184): 0,0 100.33,0 100.33,80.01 0,80.01 0,78.74

### Text on the board
Bottom: Groupe 5 / Van Waesberghe Christophe / Rousseau Mathieu / Courtin Amélie / Dolinski Nathan